# Altium schematic sheet Top Level.SchDoc
size A4; SheetNumber: 1; SheetTotal: 5
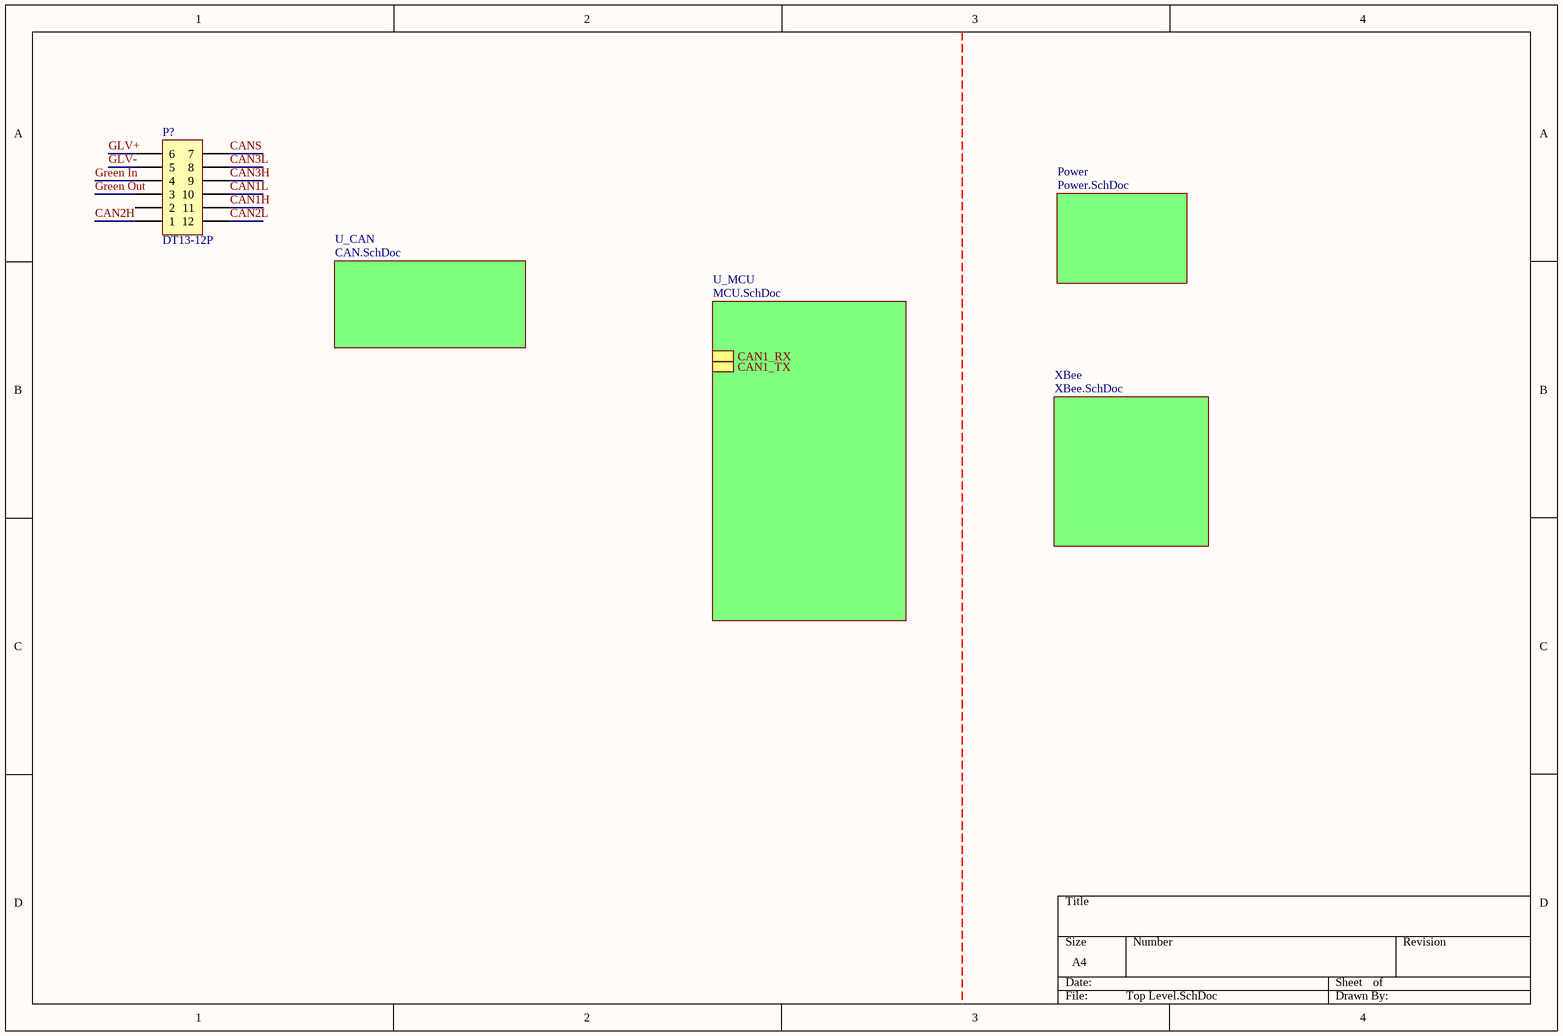
[diagram p0: Top Level.SchDoc]

## Parts
P?  DT13-12P  [DT13-12P]

## Sub-sheets
Power = Power.SchDoc: no entries
U_CAN = CAN.SchDoc: no entries
U_MCU = MCU.SchDoc: CAN1_RX, CAN1_TX
XBee = XBee.SchDoc: no entries

## Nets
CAN1H: P?.11
CAN1L: P?.10
CAN2H: P?.1
CAN2L: P?.12
CAN3H: P?.9
CAN3L: P?.8
CANS: P?.7
GLV+: P?.6
GLV-: P?.5
Green In: P?.4
Green Out: P?.3

Not connected (* = marked no-connect by the designer): P? 2

## Library data of the parts
P? = DT13-12P: Positions: 12; Pitch: 4.44mm; Row Spacing: 6.35mm; Angle: 90; Flange: Yes; Contact: Nickel; Part Number: DT13-12P; Digikey Part Number: 1734-1451-ND; Digikey Link: https://www.digikey.com.au/product-detail/en/te-connectivity-deutsch-connectors/DT13-12PA/1734-1451-ND/7220123